# Altium project WB-AV-4509-IMUBR.PrjPcb
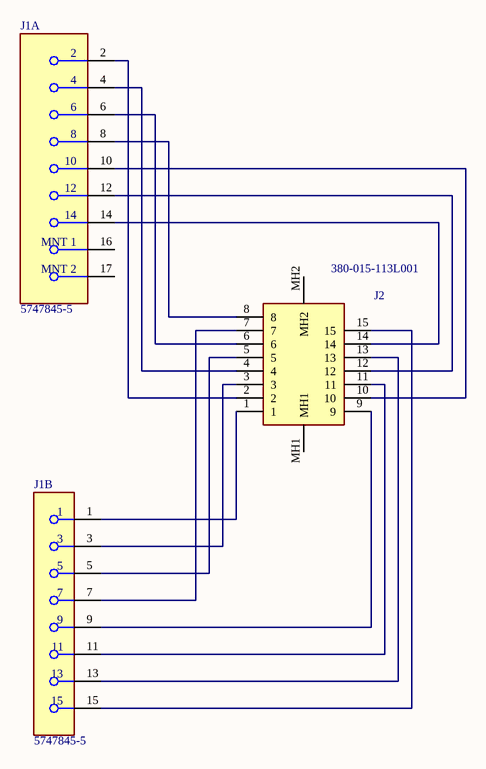
[diagram p0: 380-015-113L001.SchDoc]
1 sheet, 2 parts. Net scope: global (net labels, ports and power ports of the same name join across sheets).
Board file: WB-AV-4509-IMUBR.PcbDoc

## Sheet 380-015-113L001.SchDoc
size A4

### Parts
J1  5747845-5  [FP-5747845-5-MFG]  (parts A,B of 2)
J2  380-015-113L001  [380015113L001]

### Nets
NetJ1_1: J1.1 J2.1
NetJ1_2: J1.2 J2.2
NetJ1_3: J1.3 J2.3
NetJ1_4: J1.4 J2.4
NetJ1_5: J1.5 J2.5
NetJ1_6: J1.6 J2.6
NetJ1_7: J1.7 J2.7
NetJ1_8: J1.8 J2.8
NetJ1_9: J1.9 J2.9
NetJ1_10: J1.10 J2.10
NetJ1_11: J1.11 J2.11
NetJ1_12: J1.12 J2.12
NetJ1_13: J1.13 J2.13
NetJ1_14: J1.14 J2.14
NetJ1_15: J1.15 J2.15

Not connected (* = marked no-connect by the designer): J1 16(MNT_1) 17(MNT_2); J2 MH1 MH2

### Library data of the parts
J1 = CMP-03367-000001-1: CONN D-SUB RCPT 15POS R/A SOLDER; Manufacturer: TE Connectivity; Current Rating: 6A; Shielding: true; Is Female: yes; Pitch: 2.74mm; Conn Gender: Female; Conn Orientation: Right Angle; Number Of Contacts: 15; Temperature Range High: +105°C; Automotive: No; ComponentLink2URL: https://www.te.com/commerce/DocumentDelivery/DDEController?Action=showdoc&DocId=Catalog+Section%7F82068_AMPLIMITE_Right-Angle_Posted_Conn%7F0412%7Fpdf%7FEnglish%7FENG_CS_82068_AMPLIMITE_Right-Angle_Posted_Conn_0412.pdf%7F5747845-5; ComponentLink2Description: Datasheet; Octopart: https://octopart.com/5747845-5-te+connectivity-39499908; Device Class L3: unset; Manufacturer Part Number: 5747845-5; Mouser Description: D-Sub Standard Connectors RECP FRNT MTL SHL 15; Device Class L2: D-Sub Connectors; Contact Material: Gold,Nickel; Digikey Description: CONN D-SUB RCPT 15POS R/A SOLDER; RoHS: TRUE; Height: 0.509inch; Lead Free: Yes; Package: 5747845-5; Footprint Url: https://www.te.com/commerce/DocumentDelivery/DDEController?Action=showdoc&DocId=Customer+Drawing%7F5747845%7FA2%7Fpdf%7FEnglish%7FENG_CD_5747845_A2.pdf%7F5747845-5; Device Class L1: Connectors; Category: Conn; Temperature Range Low: -55°C; Temperature: -55°C to +105°C
J2 = 380-015-113L001: Connector; Manufacturer_Name: NorComp; Height: 10.2mm; Manufacturer_Part_Number: 380-015-113L001